# Altium schematic sheet 03)CPU-3.SchDoc
size 297 x 209 mm
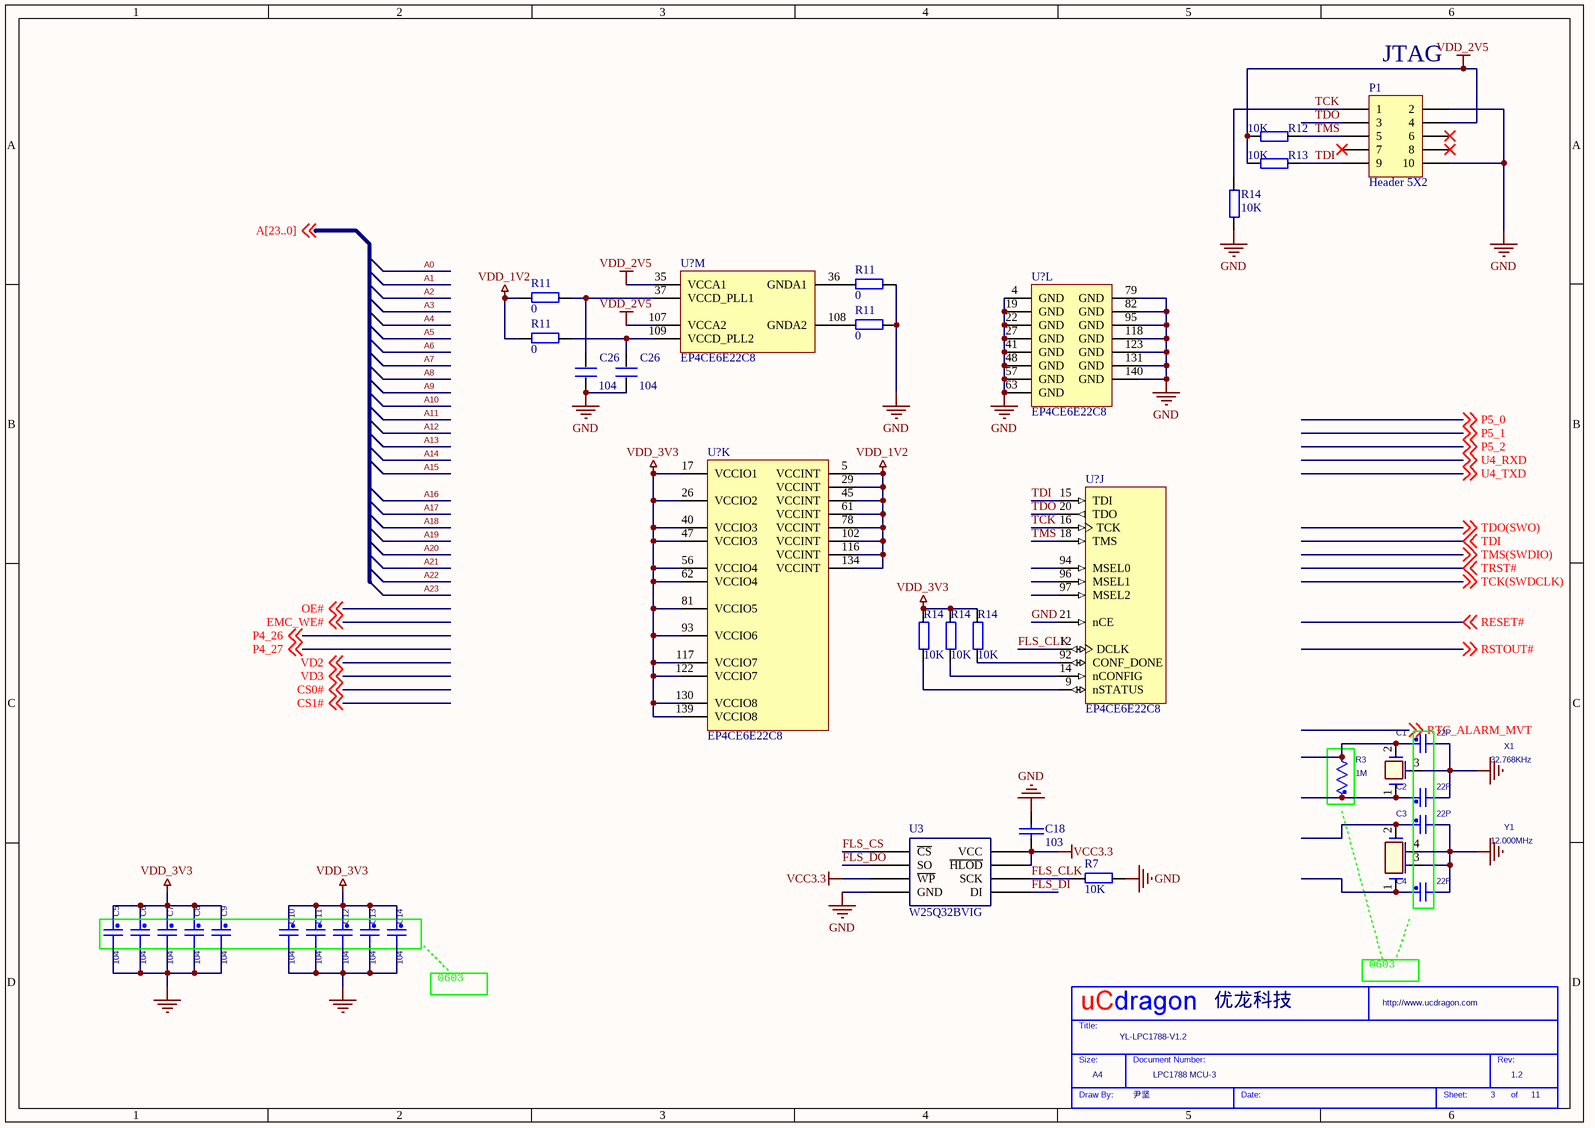
[diagram p0: 03)CPU-3.SchDoc]

## Parts
(Parts that share a designator on the sheet are numbered #1, #2 ... from top to bottom, then left to right.)
*  Page Count: 11  Page Number: 3  Page Size: A4  Title: YL-LPC1788-V1.2  RevCode: 1.2  Doc: LPC1788 MCU-3  Drawing: 尹坚  Company: 优龙科技  (hidden comment: My Title 0)  (graphical)
C1  22P  [CAP0805]
C2  22P  [CAP0805]
C3  22P  [CAP0805]
C4  22P  [CAP0805]
C5  104  [CAP0805]
C6  104  [CAP0805]
C7  104  [CAP0805]
C8  104  [CAP0805]
C9  104  [CAP0805]
C10  104  [CAP0805]
C11  104  [CAP0805]
C12  104  [CAP0805]
C13  104  [CAP0805]
C14  104  [CAP0805]
C18  103  [0603]
C26#1  104  [0603]
C26#2  104  [0603]
P1  Header 5X2  [HDR2X5]
R3  1M
R7  10K  [0603]
R11#1  0  [0603]
R11#2  0  [0603]
R11#3  0  [0603]
R11#4  0  [0603]
R12  10K  [0603]
R13  10K  [0603]
R14#1  10K  [0603]
R14#2  10K  [0603]
R14#3  10K  [0603]
R14#4  10K  [0603]
U3  W25Q32BVIG  [8S2]
U?#1  EP4CE6E22C8  [EQFP144_N]  (part M of 13)
U?#2  EP4CE6E22C8  [EQFP144_N]  (part L of 13)
U?#3  EP4CE6E22C8  [EQFP144_N]  (part K of 13)
U?#4  EP4CE6E22C8  [EQFP144_N]  (part J of 13)
X1  32.768KHz
Y1  12.000MHz

## Nets
GND: C18.2 C26#1.2 C26#2.2 P1.2 P1.10 R7.1 R11#1.1 R11#3.1 R14#1.1 U3.4(GND) U?#2.4(GND) U?#2.19(GND) U?#2.22(GND) U?#2.27(GND) U?#2.41(GND) U?#2.48(GND) U?#2.57(GND) U?#2.63(GND) U?#2.79(GND) U?#2.82(GND) U?#2.95(GND) U?#2.118(GND) U?#2.123(GND) U?#2.131(GND) U?#2.140(GND) U?#4.21(nCE)
GND_POWER: C1.2 C2.2 C3.2 C4.2 C5.2 C6.2 C7.2 C8.2 C9.2 C10.2 C11.2 C12.2 C13.2 C14.2 X1.3(GND) Y1.3(GND) Y1.4(GND)
VCC3.3: C18.1 U3.3(~{WP}) U3.7(~{HLOD}) U3.8(VCC)
VDD_1V2: R11#2.2 R11#4.2 U?#3.5(VCCINT) U?#3.29(VCCINT) U?#3.45(VCCINT) U?#3.61(VCCINT) U?#3.78(VCCINT) U?#3.102(VCCINT) U?#3.116(VCCINT) U?#3.134(VCCINT)
VDD_2V5: P1.4 R12.1 R13.1 U?#1.35(VCCA1) U?#1.107(VCCA2)
VDD_3V3: C5.1 C6.1 C7.1 C8.1 C9.1 C10.1 C11.1 C12.1 C13.1 C14.1 R14#2.2 R14#3.2 R14#4.2 U?#3.17(VCCIO1) U?#3.26(VCCIO2) U?#3.40(VCCIO3) U?#3.47(VCCIO3) U?#3.56(VCCIO4) U?#3.62(VCCIO4) U?#3.81(VCCIO5) U?#3.93(VCCIO6) U?#3.117(VCCIO7) U?#3.122(VCCIO7) U?#3.130(VCCIO8) U?#3.139(VCCIO8)
FLS_CLK: R7.2 U3.6(SCK) U?#4.12(DCLK)
FLS_CS: U3.1(~{CS})
FLS_DI: U3.5(DI)
FLS_DO: U3.2(SO)
TCK: P1.1 R14#1.2 U?#4.16(TCK)
TDI: P1.9 R13.2 U?#4.15(TDI) ; off-sheet TDI
TDO: P1.3 U?#4.20(TDO)
TMS: P1.5 R12.2 U?#4.18(TMS)
NetC1_1: C1.1 R3.2 X1.2
NetC2_1: C2.1 R3.1 X1.1
NetC3_1: C3.1 Y1.2
NetC4_1: C4.1 Y1.1
NetC26#1_1: C26#1.1 R11#2.1 U?#1.37(VCCD_PLL1)
NetC26#2_1: C26#2.1 R11#4.1 U?#1.109(VCCD_PLL2)
NetR11#1_2: R11#1.2 U?#1.36(GNDA1)
NetR11#3_2: R11#3.2 U?#1.108(GNDA2)
NetR14#2_1: R14#2.1 U?#4.9(nSTATUS)
NetR14#3_1: R14#3.1 U?#4.14(nCONFIG)
NetR14#4_1: R14#4.1 U?#4.92(CONF_DONE)

Not connected (* = marked no-connect by the designer): P1 6* 7* 8*; U?#4 94(MSEL0) 96(MSEL1) 97(MSEL2)

## Notes on the sheet
- (near P1) JTAG
- 0603
- (in symbol My Title 0) Title:; Size:; Document Number:; Rev:; Draw By:; Date:; Sheet:; of

## Library data of the parts
C1-C14 = C_Generic_Dup2
C18 = CAP: Capacitor
C26#1 C26#2 = C
P1 = Header 5X2: Header, 5-Pin, Dual row; LatestRevisionDate: 17-Jul-2002; LatestRevisionNote: Re-released for DXP Platform.; Publisher: Altium Limited
R3 = R_Generic_Dup2
R7 R11#1-R11#4 R12 R13 R14#1-R14#4 = R
U?#1-U?#4 = EP4CE6E22C8: Cyclone IV Family FPGA, 2V Core, 91 I/O Pins, 2 PLLs, 144-Pin QFP, Speed Grade 8, Commercial Grade; Published: 3-May-2010; DatasheetVersion: ver1.2, Mar-2010; PackageVersion: ver16.0, Dec-2009; PackageReference: EQFP144; Publisher: Altium Limited; PackageDescription: 144-Pin Plastic Enhanced Quad Flat Pack (EQFP144) - Wire Bond; Code_JEDEC: MS-026-BFB; ComponentLink1Description: Manufacturer Link; ComponentLink1URL: http://www.altera.com/; ComponentLink2Description: Handbook; ComponentLink2URL: http://www.altera.com/literature/hb/cyclone-iv/cyclone4-handbook.pdf; ComponentLink3Description: Pinout Specification; ComponentLink3URL: http://www.altera.com/literature/lit-dp.jsp?category=cyc%204&showspreadsheet=y; ComponentLink4Description: Packaging Specification; ComponentLink4URL: http://www.altera.com/literature/ds/dspkg.pdf
X1 = XTAL1
Y1 = XTAL3
* = My Title 0: Page Create Date: May 29, 2006; WebSite: http://www.ucdragon.com